# EAGLE design STM32_CAN-USB (EAGLE 7.1.0)
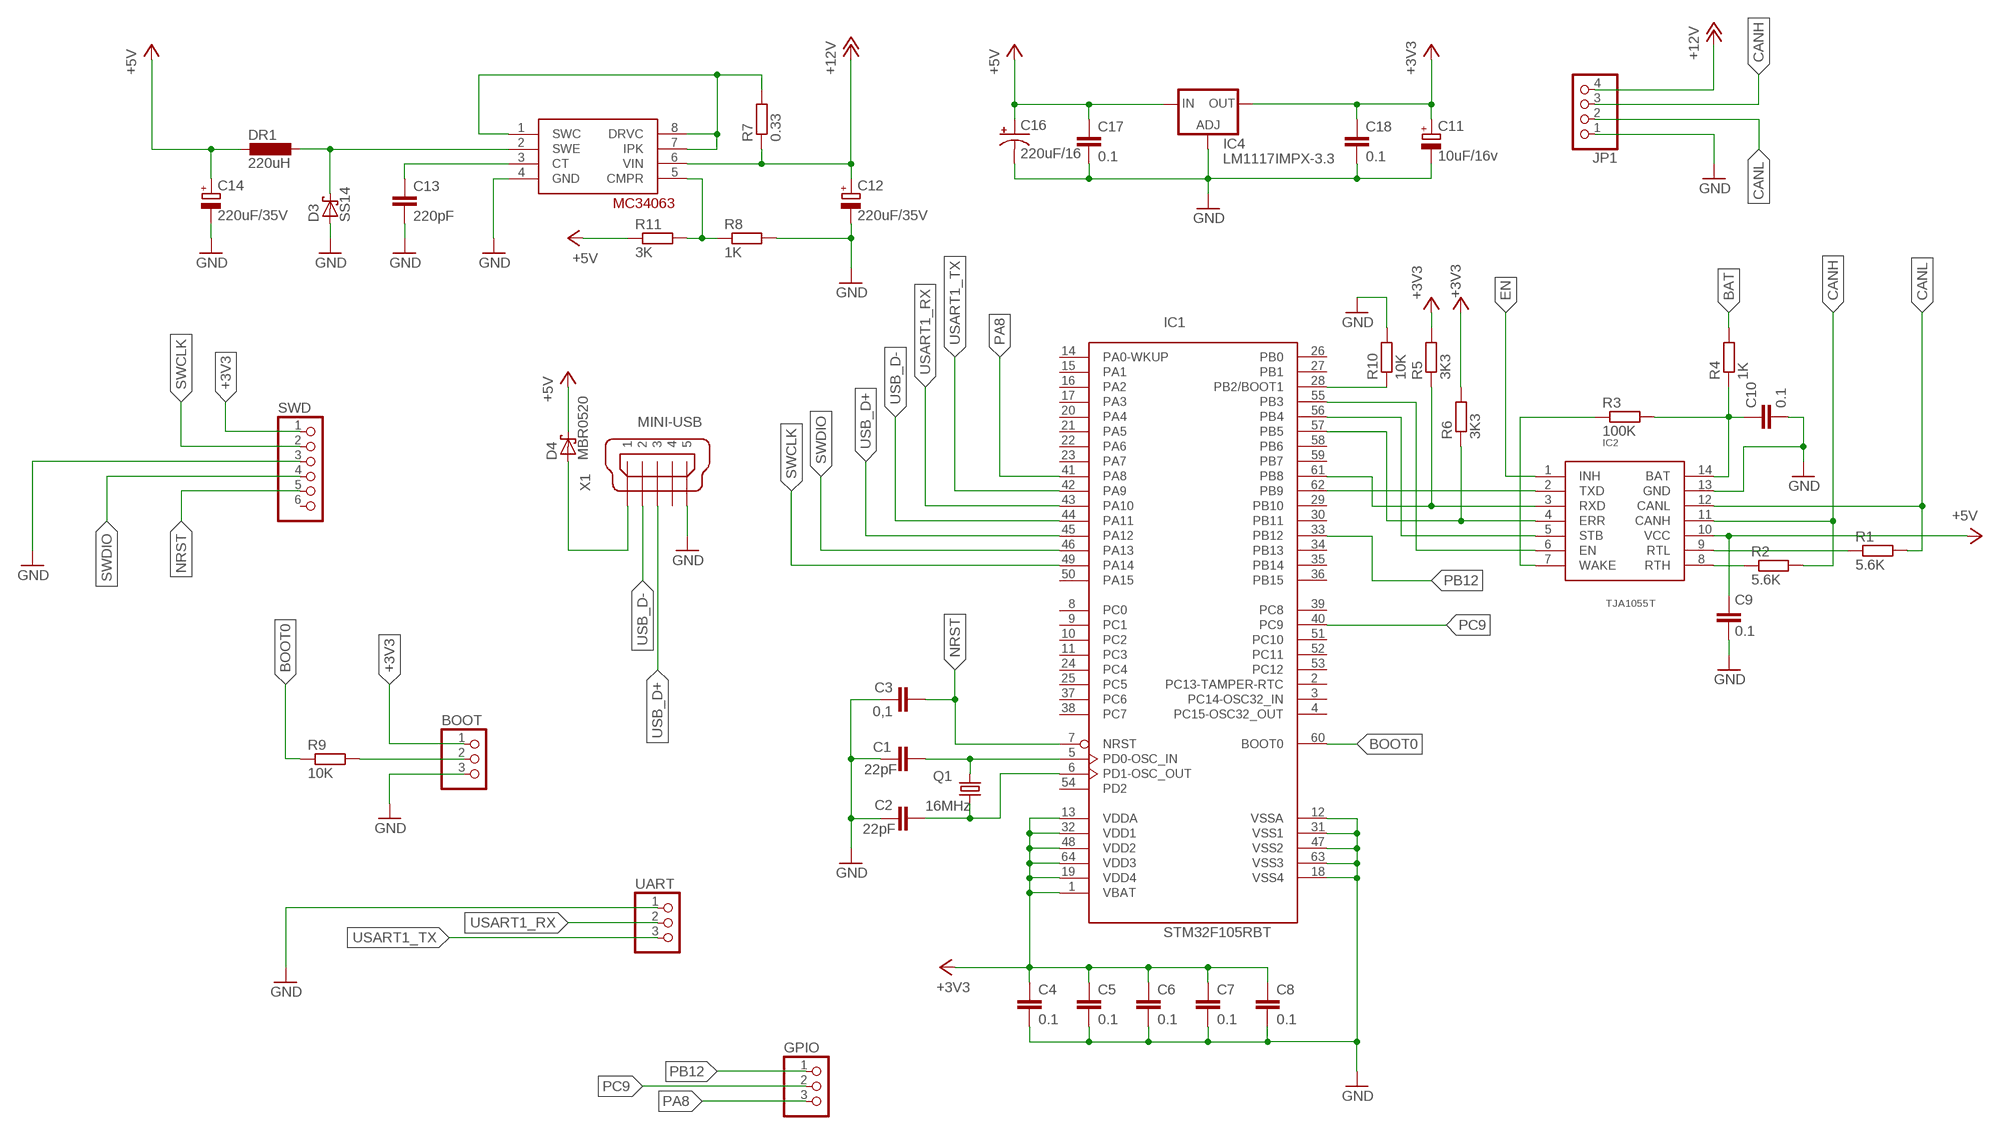
[diagram p0: schematic, sheet 1]

## Parts
BOOT  PINHD-1X3  [1X03]
C1  22pF  C-EUC0805  [C0805]
C2  22pF  C-EUC0805  [C0805]
C3  0,1  C-EUC0805  [C0805]
C4  0.1  C-EUC0805  [C0805]
C5  0.1  C-EUC0805  [C0805]
C6  0.1  C-EUC0805  [C0805]
C7  0.1  C-EUC0805  [C0805]
C8  0.1  C-EUC0805  [C0805]
C9  0.1  C-EUC0805  [C0805]
C10  0.1  C-EUC0805  [C0805]
C11  10uF/16v  CPOL-EUSMCA  [SMC_A]
C12  220uF/35V  CPOL-EU153CLV-0810  [153CLV-0810]
C13  220pF  C-EUC0805  [C0805]
C14  220uF/35V  CPOL-EU153CLV-0810  [153CLV-0810]
C16  220uF/16  CPOL-US153CLV-0605  [153CLV-0605]
C17  0.1  C-EUC0805  [C0805]
C18  0.1  C-EUC0805  [C0805]
D3  SS14  [SMA]
D4  MBR0520  [SOD123]
DR1  220uH  CDRH127  [MS85]
GPIO  PINHD-1X3  [1X03]
IC1  STM32F105RBT  [LQFP64]
IC2  TJA1055T  TJA1054T  [SO-14W]
IC4  LM1117IMPX-3.3  [SOT223]
JP1  PINHD-1X4  [1X04]
MC34063  MC34063  [SO8]
Q1  16MHz  CRYSTALHC49UP  [HC49UP]
R1  5.6K  R-EU_R0805  [R0805]
R2  5.6K  R-EU_R0805  [R0805]
R3  100K  R-EU_R0805  [R0805]
R4  1K  R-EU_R0805  [R0805]
R5  3K3  R-EU_R0805  [R0805]
R6  3K3  R-EU_R0805  [R0805]
R7  0.33  R-EU_R0805  [R0805]
R8  1K  R-EU_R0805  [R0805]
R9  10K  R-EU_R0805  [R0805]
R10  10K  R-EU_R0805  [R0805]
R11  3K  R-EU_R0805  [R0805]
SWD  PINHD-1X6  [1X06]
UART  PINHD-1X3  [1X03]
X1  MINI-USB  MINI-USB-UX60-MB-5ST  [UX60-MB-5ST]

## Nets
+3V3: BOOT.1 C4.1 C5.1 C6.1 C7.1 C8.1 C11.+ C18.1 IC1.1(VBAT) IC1.13(VDDA) IC1.19(VDD4) IC1.32(VDD1) IC1.48(VDD2) IC1.64(VDD3) IC4.2(OUT) IC4.4(OUT) R5.2 R6.2 SWD.1
+5V: C9.1 C14.+ C16.+ C17.1 D4.C DR1.P$1 IC2.10(VCC) IC4.3(IN) R11.1
+12V: C12.+ JP1.4 MC34063.6(VIN) R7.1
BAT: R4.2
BOOT0: IC1.60(BOOT0) R9.1
CANH: IC2.11(CANH) JP1.3 R2.2
CANL: IC2.12(CANL) JP1.2 R1.2
EN: IC2.1(INH)
GND: BOOT.3 C1.2 C2.2 C3.1 C4.2 C5.2 C6.2 C7.2 C8.2 C9.2 C10.2 C11.- C12.- C13.2 C14.- C16.- C17.2 C18.2 D3.A IC1.12(VSSA) IC1.18(VSS4) IC1.31(VSS1) IC1.47(VSS2) IC1.63(VSS3) IC2.13(GND) IC4.1(ADJ) JP1.1 MC34063.4(GND) R8.2 R10.2 SWD.3 UART.1 X1.5 X1.M1 X1.M2
N$1: C1.1 IC1.5(PD0-OSC_IN) Q1.2
N$2: C2.1 IC1.6(PD1-OSC_OUT) Q1.1
N$3: BOOT.2 R9.2
N$7: IC2.8(RTH) R2.1
N$8: IC2.9(RTL) R1.1
N$9: MC34063.1(SWC) MC34063.7(IPK) MC34063.8(DRVC) R7.2
N$10: IC2.7(WAKE) R3.1
N$11: C10.1 IC2.14(BAT) R3.2 R4.1
N$12: MC34063.5(CMPR) R8.1 R11.2
N$13: D3.C DR1.P$2 MC34063.2(SWE)
N$16: IC1.28(PB2/BOOT1) R10.1
N$18: C13.1 MC34063.3(CT)
N$19: D4.A X1.1
NRST: C3.2 IC1.7(NRST) SWD.5
PA8: GPIO.3 IC1.41(PA8)
PB12: GPIO.1 IC1.33(PB12)
PC9: GPIO.2 IC1.40(PC9)
SWCLK: IC1.49(PA14) SWD.2
SWDIO: IC1.46(PA13) SWD.4
TJA_EN: IC1.55(PB3) IC2.6(EN)
TJA_ERR: IC1.57(PB5) IC2.4(ERR) R6.1
TJA_RXD: IC1.61(PB8) IC2.3(RXD) R5.1
TJA_STB: IC1.56(PB4) IC2.5(STB)
TJA_TXD: IC1.62(PB9) IC2.2(TXD)
USART1_RX: IC1.43(PA10) UART.2
USART1_TX: IC1.42(PA9) UART.3
USB_D+: IC1.45(PA12) X1.3
USB_D-: IC1.44(PA11) X1.2
Unconnected: IC1.2(PC13-TAMPER-RTC) IC1.3(PC14-OSC32_IN) IC1.4(PC15-OSC32_OUT) IC1.8(PC0) IC1.9(PC1) IC1.10(PC2) IC1.11(PC3) IC1.14(PA0-WKUP) IC1.15(PA1) IC1.16(PA2) IC1.17(PA3) IC1.20(PA4) IC1.21(PA5) IC1.22(PA6) IC1.23(PA7) IC1.24(PC4) IC1.25(PC5) IC1.26(PB0) IC1.27(PB1) IC1.29(PB10) IC1.30(PB11) IC1.34(PB13) IC1.35(PB14) IC1.36(PB15) IC1.37(PC6) IC1.38(PC7) IC1.39(PC8) IC1.50(PA15) IC1.51(PC10) IC1.52(PC11) IC1.53(PC12) IC1.54(PD2) IC1.58(PB6) IC1.59(PB7) SWD.6 X1.4

## Library data of the parts
BOOT GPIO UART = pinhead:PINHD-1X3: PIN HEADER
C1-C10 C13 C17 C18 = rcl:C-EU: CAPACITOR, European symbol
C11 C12 C14 = rcl:CPOL-EU: POLARIZED CAPACITOR, European symbol
C16 = rcl:CPOL-US: POLARIZED CAPACITOR, American symbol
D3 = STM32_CAN-USB:SS14
D4 = STM32_CAN-USB:MBR0520
DR1 = STM32_CAN-USB:CDRH127
IC1 = STM32_CAN-USB:STM32F105R*T: ARM 32-bit Cortex™-M3 CPU 72 MHz maximum frequency 64 to 256 Kbytes of Flash memory 64 kbytes of SRAM 51 GPIOs 2.0 to 3.6 V application supply
IC2 = STM32_CAN-USB:TJA1054T
IC4 = STM32_CAN-USB:LM1117IMPX-3.3
JP1 = pinhead:PINHD-1X4: PIN HEADER
MC34063 = STM32_CAN-USB:MC34063
Q1 = crystal:CRYSTAL: CRYSTAL; OC_FARNELL: unknown; OC_NEWARK: unknown
R1-R11 = rcl:R-EU_: RESISTOR, European symbol
SWD = pinhead:PINHD-1X6: PIN HEADER
X1 = STM32_CAN-USB:MINI-USB-: MINI USB Connector Source: http://www.hirose.co.jp/cataloge_hp/e24000019.pdf; OC_FARNELL: unknown; OC_NEWARK: unknown

## Board
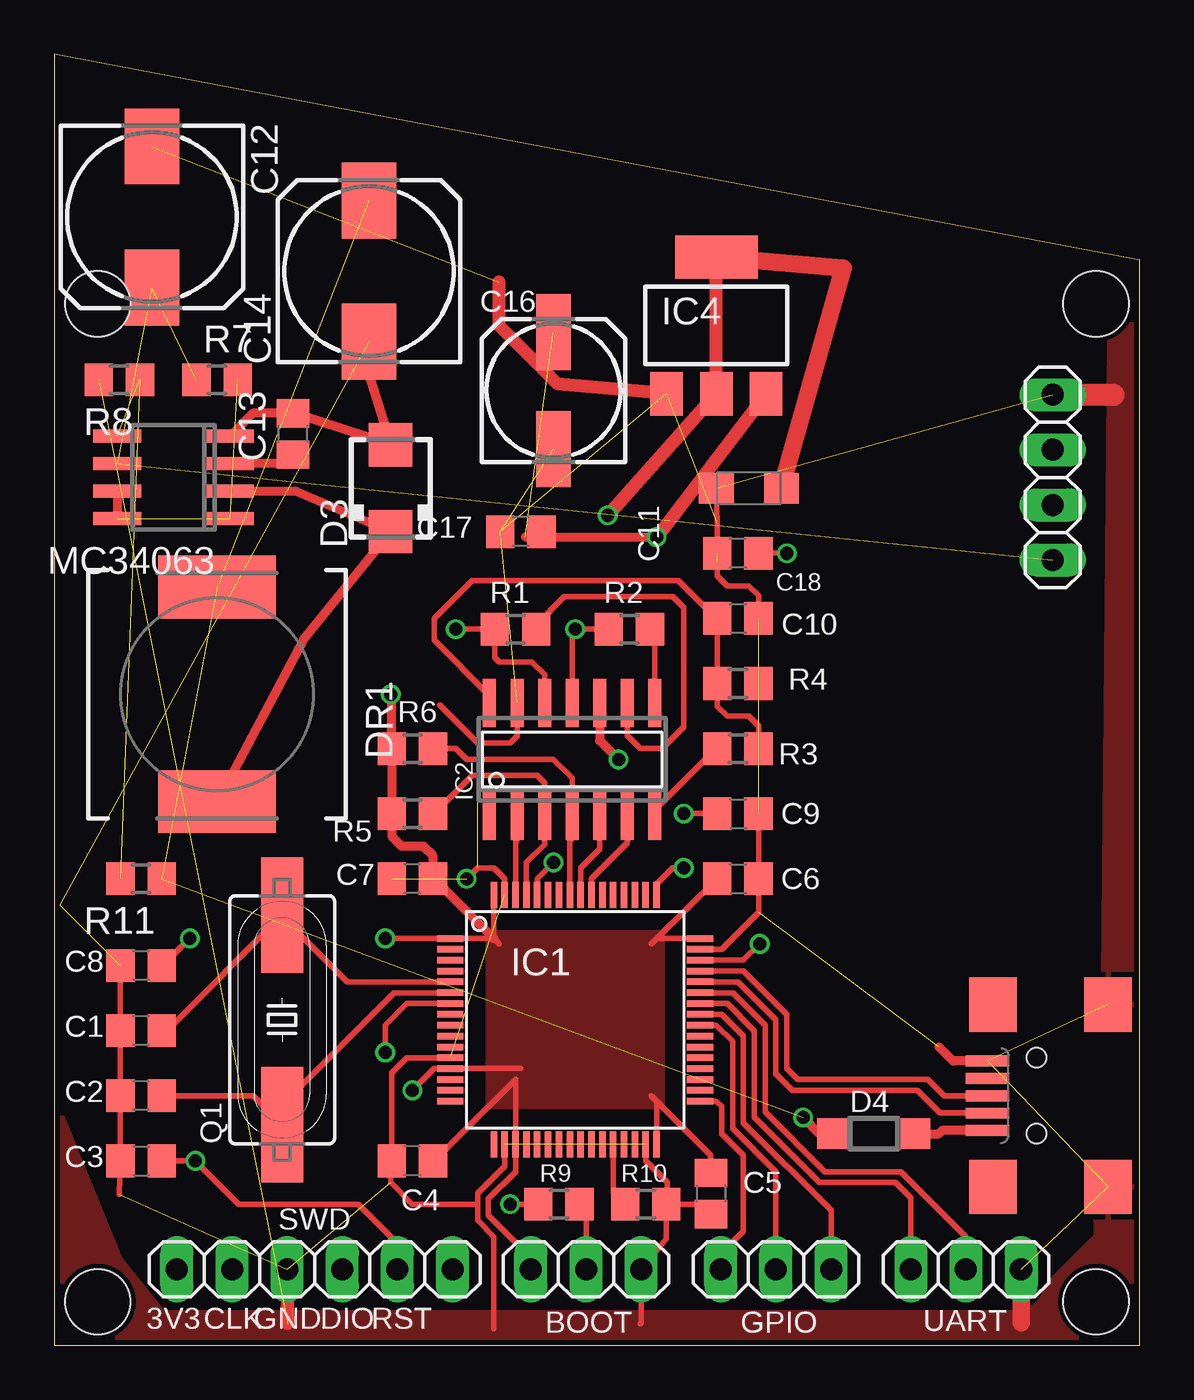
[diagram p1: board, top side]
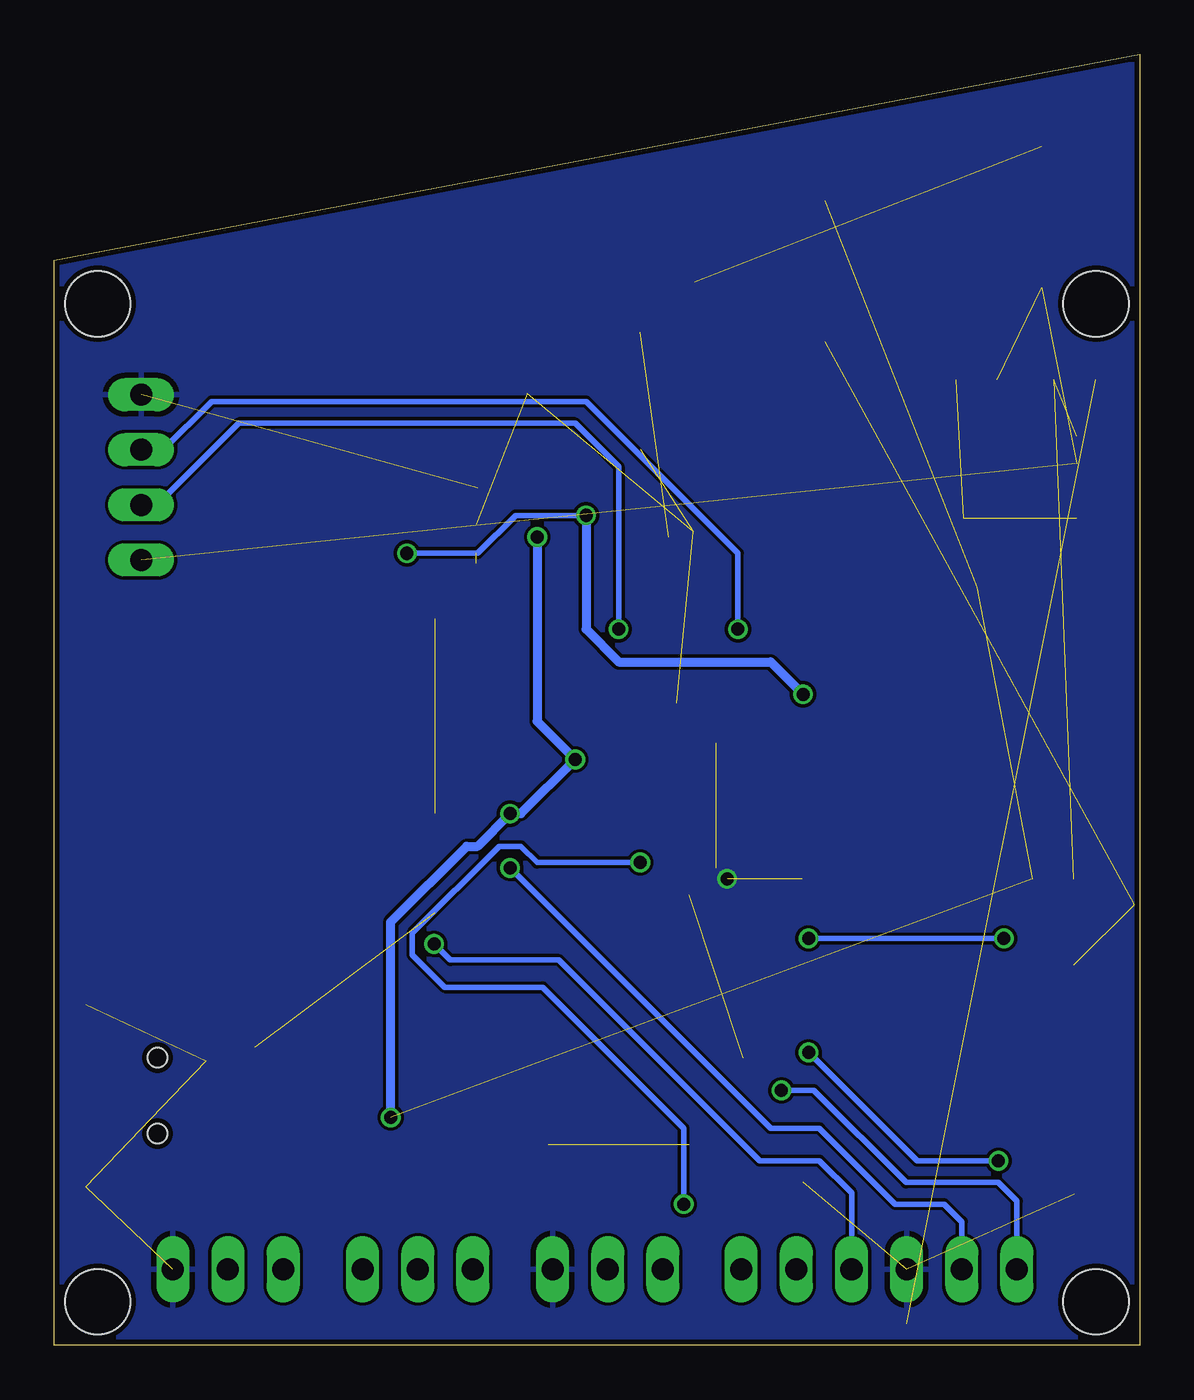
[diagram p2: board, bottom side, seen from below]

Size 50 x 59.5 mm. Coordinates in mm from the lower left corner, seen from the top.
Outline: 0,0 50,0 50,50 0,59.5 0,0
Copper layers (1*16): Top 0.035mm / dielectric 1.5mm / Bottom 0.035mm
Design rules "ITEADstudio_DRC": minimum track width 6mil, minimum drill 12mil, track to track 6mil, track to pad 6mil, pad to pad 6mil, via to via 6mil, smd to smd 0mil, copper to edge 10mil, drill to drill 10mil, minimum pad ring 10mil, minimum via ring 6mil, stop-mask expansion 2mil, vias tented up to drill 100mil, thermal gap 10mil
Holes 3 mm at 2,2 2,48 48,48 48,2

### Footprints (pad centres in the part's own frame; a part is rotated, then mirrored left to right if it is on the bottom)
1X03 = drill 1.016 long: 1 -2.54,0; 2 0,0; 3 2.54,0
C0805 = smd 1.3 x 1.5: 1 -0.95,0; 2 0.95,0
SMC_A = smd 1.6 x 1.4: + -1.5,0; - 1.5,0
153CLV-0810 = smd 3.5 x 2.5: + 3.25,0; - -3.25,0
153CLV-0605 = smd 3.5 x 1.6: + 2.7,0; - -2.7,0
SMA = smd 2 x 2: A 2,0; C -2,0
SOD123 = smd 1.4 x 1.4: A 1.9,0; C -1.9,0
MS85 = smd 5.4 x 2.9: P$1 0,4.95; P$2 0,-4.95
LQFP64 = smd 1.2 x 0.3: 1 -5.75,3.75; 2 -5.75,3.25; 3 -5.75,2.75; 4 -5.75,2.25; 5 -5.75,1.75; 6 -5.75,1.25; 7 -5.75,0.75; 8 -5.75,0.25; 9 -5.75,-0.25; 10 -5.75,-0.75; 11 -5.75,-1.25; 12 -5.75,-1.75; 13 -5.75,-2.25; 14 -5.75,-2.75; 15 -5.75,-3.25; 16 -5.75,-3.75; 33 5.75,-3.75; 34 5.75,-3.25; 35 5.75,-2.75; 36 5.75,-2.25; 37 5.75,-1.75; 38 5.75,-1.25; 39 5.75,-0.75; 40 5.75,-0.25; 41 5.75,0.25; 42 5.75,0.75; 43 5.75,1.25; 44 5.75,1.75; 45 5.75,2.25; 46 5.75,2.75; 47 5.75,3.25; 48 5.75,3.75 | smd 0.3 x 1.2: 17 -3.75,-5.75; 18 -3.25,-5.75; 19 -2.75,-5.75; 20 -2.25,-5.75; 21 -1.75,-5.75; 22 -1.25,-5.75; 23 -0.75,-5.75; 24 -0.25,-5.75; 25 0.25,-5.75; 26 0.75,-5.75; 27 1.25,-5.75; 28 1.75,-5.75; 29 2.25,-5.75; 30 2.75,-5.75; 31 3.25,-5.75; 32 3.75,-5.75; 49 3.75,5.75; 50 3.25,5.75; 51 2.75,5.75; 52 2.25,5.75; 53 1.75,5.75; 54 1.25,5.75; 55 0.75,5.75; 56 0.25,5.75; 57 -0.25,5.75; 58 -0.75,5.75; 59 -1.25,5.75; 60 -1.75,5.75; 61 -2.25,5.75; 62 -2.75,5.75; 63 -3.25,5.75; 64 -3.75,5.75
SO-14W = smd 0.6 x 2.2: 1 -3.81,-2.6; 2 -2.54,-2.6; 3 -1.27,-2.6; 4 0,-2.6; 5 1.27,-2.6; 6 2.54,-2.6; 7 3.81,-2.6; 8 3.81,2.6; 9 2.54,2.6; 10 1.27,2.6; 11 0,2.6; 12 -1.27,2.6; 13 -2.54,2.6; 14 -3.81,2.6
SOT223 = smd 1.5 x 2: 1 -2.3,-3.15; 2 0,-3.15; 3 2.3,-3.15 | smd 3.8 x 2: 4 0,3.15
1X04 = drill 1.016 long: 1 -3.81,0; 2 -1.27,0; 3 1.27,0; 4 3.81,0
SO8 = smd 0.6 x 2.2: 1 -1.905,-2.6; 2 -0.635,-2.6; 3 0.635,-2.6; 4 1.905,-2.6; 5 1.905,2.6; 6 0.635,2.6; 7 -0.635,2.6; 8 -1.905,2.6
HC49UP = smd 5.334 x 1.93: 1 -4.826,0; 2 4.826,0
R0805 = smd 1.3 x 1.5: 1 -0.95,0; 2 0.95,0
1X06 = drill 1.016 long: 1 -6.35,0; 2 -3.81,0; 3 -1.27,0; 4 1.27,0; 5 3.81,0; 6 6.35,0
UX60-MB-5ST = smd 2 x 0.5: 1 2.25,1.6; 2 2.25,0.8; 3 2.25,0; 4 2.25,-0.8; 5 2.25,-1.6 | smd 2.2 x 2.5: M1 -3.3,-4.2; M2 -3.3,4.2; M3 2,4.2; M4 2,-4.2 | hole 0.9: 0,-1.75; 0,1.75

### Placement (x,y rotation side)
BOOT  24.5,3.5 0 top
C1  4,14.5 180 top
C2  4,11.5 180 top
C3  4,8.5 0 top
C4  16.5,8.5 180 top
C5  30.25,7 270 top
C6  31.5,21.5 0 top
C7  16.5,21.5 180 top
C8  4,17.5 180 top
C9  31.5,24.5 0 top
C10  31.5,33.5 0 top
C11  32,39.5 180 top
C12  4.5,52 270 top
C13  11,42 90 top
C14  14.5,49.5 90 top
C16  23,44 90 top
C17  21.5,37.5 180 top
C18  31.5,36.5 180 top
D3  15.5,39.5 90 top
D4  37.75,9.75 0 top
DR1  7.5,30 0 top
GPIO  33.25,3.5 0 top
IC1  24,15 0 top
IC2  23.86,27 0 top
IC4  30.5,47 0 top
JP1  46,40 270 top
MC34063  5.5,40 90 top
Q1  10.5,15 90 top
R1  21.25,33 180 top
R2  26.5,33 180 top
R3  31.5,27.5 0 top
R4  31.5,30.5 0 top
R5  16.5,24.5 180 top
R6  16.5,27.5 180 top
R7  7.5,44.5 0 top
R8  3,44.5 180 top
R9  23.25,6.5 0 top
R10  27.25,6.5 0 top
R11  4,21.5 180 top
SWD  12,3.5 0 top
UART  42,3.5 180 top
X1  45.25,11.5 180 top

### Tracks (layer width: path | path; a pad name or v marks a point on that pad's centre or on a via)
+3V3  (via drill 0.6)
  Top 0.254: C4.1 17.5,8.5 21.25,12.25 IC1.19 21.25,8 20,6.75 20,6 21.96,4.04 BOOT.1 | IC1.32 27.75,11.25 | 27.75,11.25 27.5,11.5 | C6.1 27.75,18.75 | 27.75,18.75 27.5,18.5 | IC1.48 27.75,18.75 | C7.1 17.5,21.5 | IC1.64 20.25,18.75 | 20.25,18.75 IC1.1 v15.25,18.75 | 20.25,18.75 20.5,18.5 | 21.5,12.75 IC1.13 17.5,12.75 v16.5,11.75 | v6.25,18.75 5,17.5 C8.1 | 15.55,29.95 v15.5,30 | C5.1 30.25,8.75 27.75,11.25 | v33.75,36.5 C18.1
  Top 0.406: 17.5,21.5 20.25,18.75 | 15.55,29.95 R6.2 R5.2 15.55,23.45 16,23 17,23 17.45,22.55 C7.1
  Top 0.61: v25.5,38.25 IC4.2 IC4.4
  Top 0.813: IC4.4 36.35,49.65 C11.+
  Bottom 0.254: v15.25,18.75 v6.25,18.75 | SWD.1 5.65,6.65 6.5,7.5 10.75,7.5 15,11.75 v16.5,11.75 | v25.5,38.25 28.75,38.25 30.5,36.5 v33.75,36.5
  Bottom 0.406: v25.5,38.25 25.5,33 24,31.5 17,31.5 v15.5,30
  pour Top: 28,19 20,19 20,11 28,11
+5V  (via drill 0.6)  (4 unrouted)
  Top 0.254: v29,24.5 C9.1 | v27.75,37.25 27.8,37.3 | C17.1 21.7,37.25
  Top 0.406: IC2.10 25.13,27.87 v26,27 | 21.7,37.25 v27.75,37.25 | D4.C 35.25,9.75 v34.5,10.5
  Top 0.61: 27.8,37.3 IC4.3
  Bottom 0.406: v27.75,37.25 27.75,28.75 v26,27 28.5,24.5 v29,24.5 30.5,23 31,23 34.5,19.5 v34.5,10.5
+12V  (3 unrouted)
BOOT0  (via drill 0.6)
  Top 0.254: IC1.60 22.25,21.5 v23,22.25 | v21,6.5 R9.1
  Bottom 0.254: v23,22.25 27.75,22.25 28.5,23 29.5,23 33.5,19 33.5,18 32,16.5 27.5,16.5 21,10 v21,6.5
CANH  (via drill 0.6)
  Top 0.254: R2.2 v24,33 23.86,32.86 IC2.11
  Bottom 0.254: v24,33 24,40.5 26,42.5 41.5,42.5 45.27,38.73 JP1.3
CANL  (via drill 0.6)
  Top 0.254: IC2.12 22.59,30.91 22,31.5 20.5,31.5 20.3,31.7 R1.2 v18.5,33
  Bottom 0.254: v18.5,33 18.5,36.5 25.5,43.5 42.75,43.5 45,41.25 45.98,41.25 JP1.2
EN
  Top 0.254: 20.05,24.05 IC2.1
GND  (via drill 0.6)  (21 unrouted)
  Top 0.254: IC1.47 30.75,18.25 32.45,19.95 C6.2 C9.2 32.5,24.5 | IC1.12 16.25,13.25 15.55,12.55 C4.2 15.5,8.45 15.5,7.5 16.5,6.5 19.5,6.5 | 3,7 3,6.95 C3.1 C2.2 C1.2 C8.2 | IC2.13 21.32,28.07 21,27.75 19.5,27.75 17.75,29.5 | 32.5,33.5 C10.2 32.45,34.55 32,35 31,35 30.55,35.45 C18.2 30.55,37.85 C11.- | IC1.63 20.75,21.5 20.25,22 19.5,22 v19,21.5 | 30.55,36.05 30.5,36 | C7.2 15.5,21.5 | IC1.18 20.75,8.25 19.5,7 19.5,6.5 | IC1.31 27.25,8.5 28.25,7.5 28.25,7.2 R10.2 | R10.2 28.2,4.91 BOOT.3 27.04,1.04 27,1 | 19.5,6.5 19.5,5.75 20.25,5 20.25,0.75 | R10.2 29.8,6.5 C5.2 | 44.54,1.04 44.5,1
  Top 0.406: X1.5 41.4,13.1 40.75,13.75 | MC34063.4 9.14,42.95 C13.2 11.05,42.95 D3.A 14.5,44.75 C14.-
  Top 0.61: IC4.1 23.2,44.3 20.5,47 20.5,49 | SWD.3 10.73,1.73 10.75,1
  Top 0.813: UART.1 44.54,1.04
  Top 1.016: JP1.1 48.81,43.81
  pour Top: 52,7 48.25,7 48.75,58.75 42.5,64.5 2,65 -7.5,57.5 -12.5,34 -6,26 3,4 5,1.5 44.5,1.5 48,5 48,6.5 52,6.5 52,-1 -26.5,-5 -11.5,68.5 64,67.5
  pour Bottom: -14.5,71.5 66.5,69.5 54.5,-10 -38.5,-8
N$1
  Top 0.254: C1.1 5.17,14.5 Q1.2 10.5,19.75 13.5,16.75 IC1.5
N$2
  Top 0.254: IC1.6 15.66,16.25 10.5,11.09 Q1.1 9.17,11.5 C2.1
N$3
  Top 0.254: BOOT.2 24.5,6.2 R9.2
N$7
  Top 0.254: IC2.8 27.67,32.78 R2.1
N$8
  Top 0.254: IC2.9 26.4,28.1 27,27.5 28,27.5 29,28.5 29,34 28.5,34.5 23.5,34.5 22.2,33.2 R1.1
N$9  (2 unrouted)
  Top 0.406: MC34063.7 MC34063.8
N$10
  Top 0.254: R3.1 30.5,27.5 27.67,24.67 IC2.7
N$11
  Top 0.254: IC2.14 20.05,29.95 17.5,32.5 17.5,33.5 19.25,35.25 28.75,35.25 30.5,33.5 C10.1 R4.1 30.55,29.45 31,29 32,29 32.45,28.55 R3.2
N$12  (2 unrouted)
N$13
  Top 0.406: DR1.P$2 11.5,32.55 D3.C 11.14,39.37 MC34063.2
N$16
  Top 0.254: IC1.28 25.75,7.05 R10.1
N$18
  Top 0.406: C13.1 10.59,40.63 MC34063.3
N$19
  Top 0.406: X1.1 40.9,9.9 40.75,9.75 D4.A
NRST  (via drill 0.6)
  Top 0.254: IC1.7 16.25,15.75 15.25,14.75 v15.25,13.5 | C3.2 v6.5,8.5 8.5,6.5 14,6.5 15.81,4.69 SWD.5
  Bottom 0.254: v6.5,8.5 10.25,8.5 v15.25,13.5
PA8
  Top 0.254: IC1.41 30.75,15.25 31.75,14.25 31.75,10.25 35.79,6.21 GPIO.3
PB12
  Top 0.254: IC1.33 30.5,11.25 30.75,11 30.75,9.75 31.75,8.75 31.75,5.25 30.71,4.21 GPIO.1
PC9
  Top 0.254: IC1.40 30.5,14.75 31.25,14 31.25,10 33.25,8 GPIO.2
SWCLK  (via drill 0.6)
  Top 0.254: v29,22 28.5,22 27.75,21.25 IC1.49
  Bottom 0.254: SWD.2 8.19,5.69 9,6.5 11.25,6.5 14.75,10 17,10 v29,22
SWDIO  (via drill 0.6)
  Top 0.254: v32.5,18.5 31.75,17.75 IC1.46
  Bottom 0.254: v32.5,18.5 31.75,17.75 26.75,17.75 17.5,8.5 14.75,8.5 13.27,7.02 SWD.4
TJA_EN
  Top 0.254: IC2.6 26.4,23.15 24.75,21.5 IC1.55
TJA_ERR
  Top 0.254: R6.1 18.5,27.5 19,27 23,27 23.86,26.14 IC2.4 23.86,23.36 23.75,23.25 IC1.57
TJA_RXD
  Top 0.254: IC1.61 21.75,22.25 22.59,23.09 IC2.3 22.59,25.91 22.25,26.25 19.25,26.25 17.5,24.5 R5.1
TJA_STB
  Top 0.254: IC2.5 25.13,22.88 24.25,22 IC1.56
TJA_TXD
  Top 0.254: IC2.2 21.32,23.32 21.25,23.25 IC1.62
USART1_RX
  Top 0.254: IC1.43 31.25,16.25 32.75,14.75 32.75,10.75 35.5,8 39,8 42,5 UART.2
USART1_TX
  Top 0.254: IC1.42 31,15.75 32.25,14.5 32.25,10.5 35.25,7.5 38.75,7.5 39.46,6.79 UART.3
USB_D+
  Top 0.254: IC1.45 31.75,17.25 33.75,15.25 33.75,12.75 34.25,12.25 40.25,12.25 41,11.5 X1.3
USB_D-
  Top 0.254: IC1.44 31.5,16.75 33.25,15 33.25,12.5 34,11.75 39.75,11.75 40.8,10.7 X1.2

### Text on the board
tNames: 3V3 | CLK | GND | DIO | RST